# Altium project PCB_Project2.PrjPCB
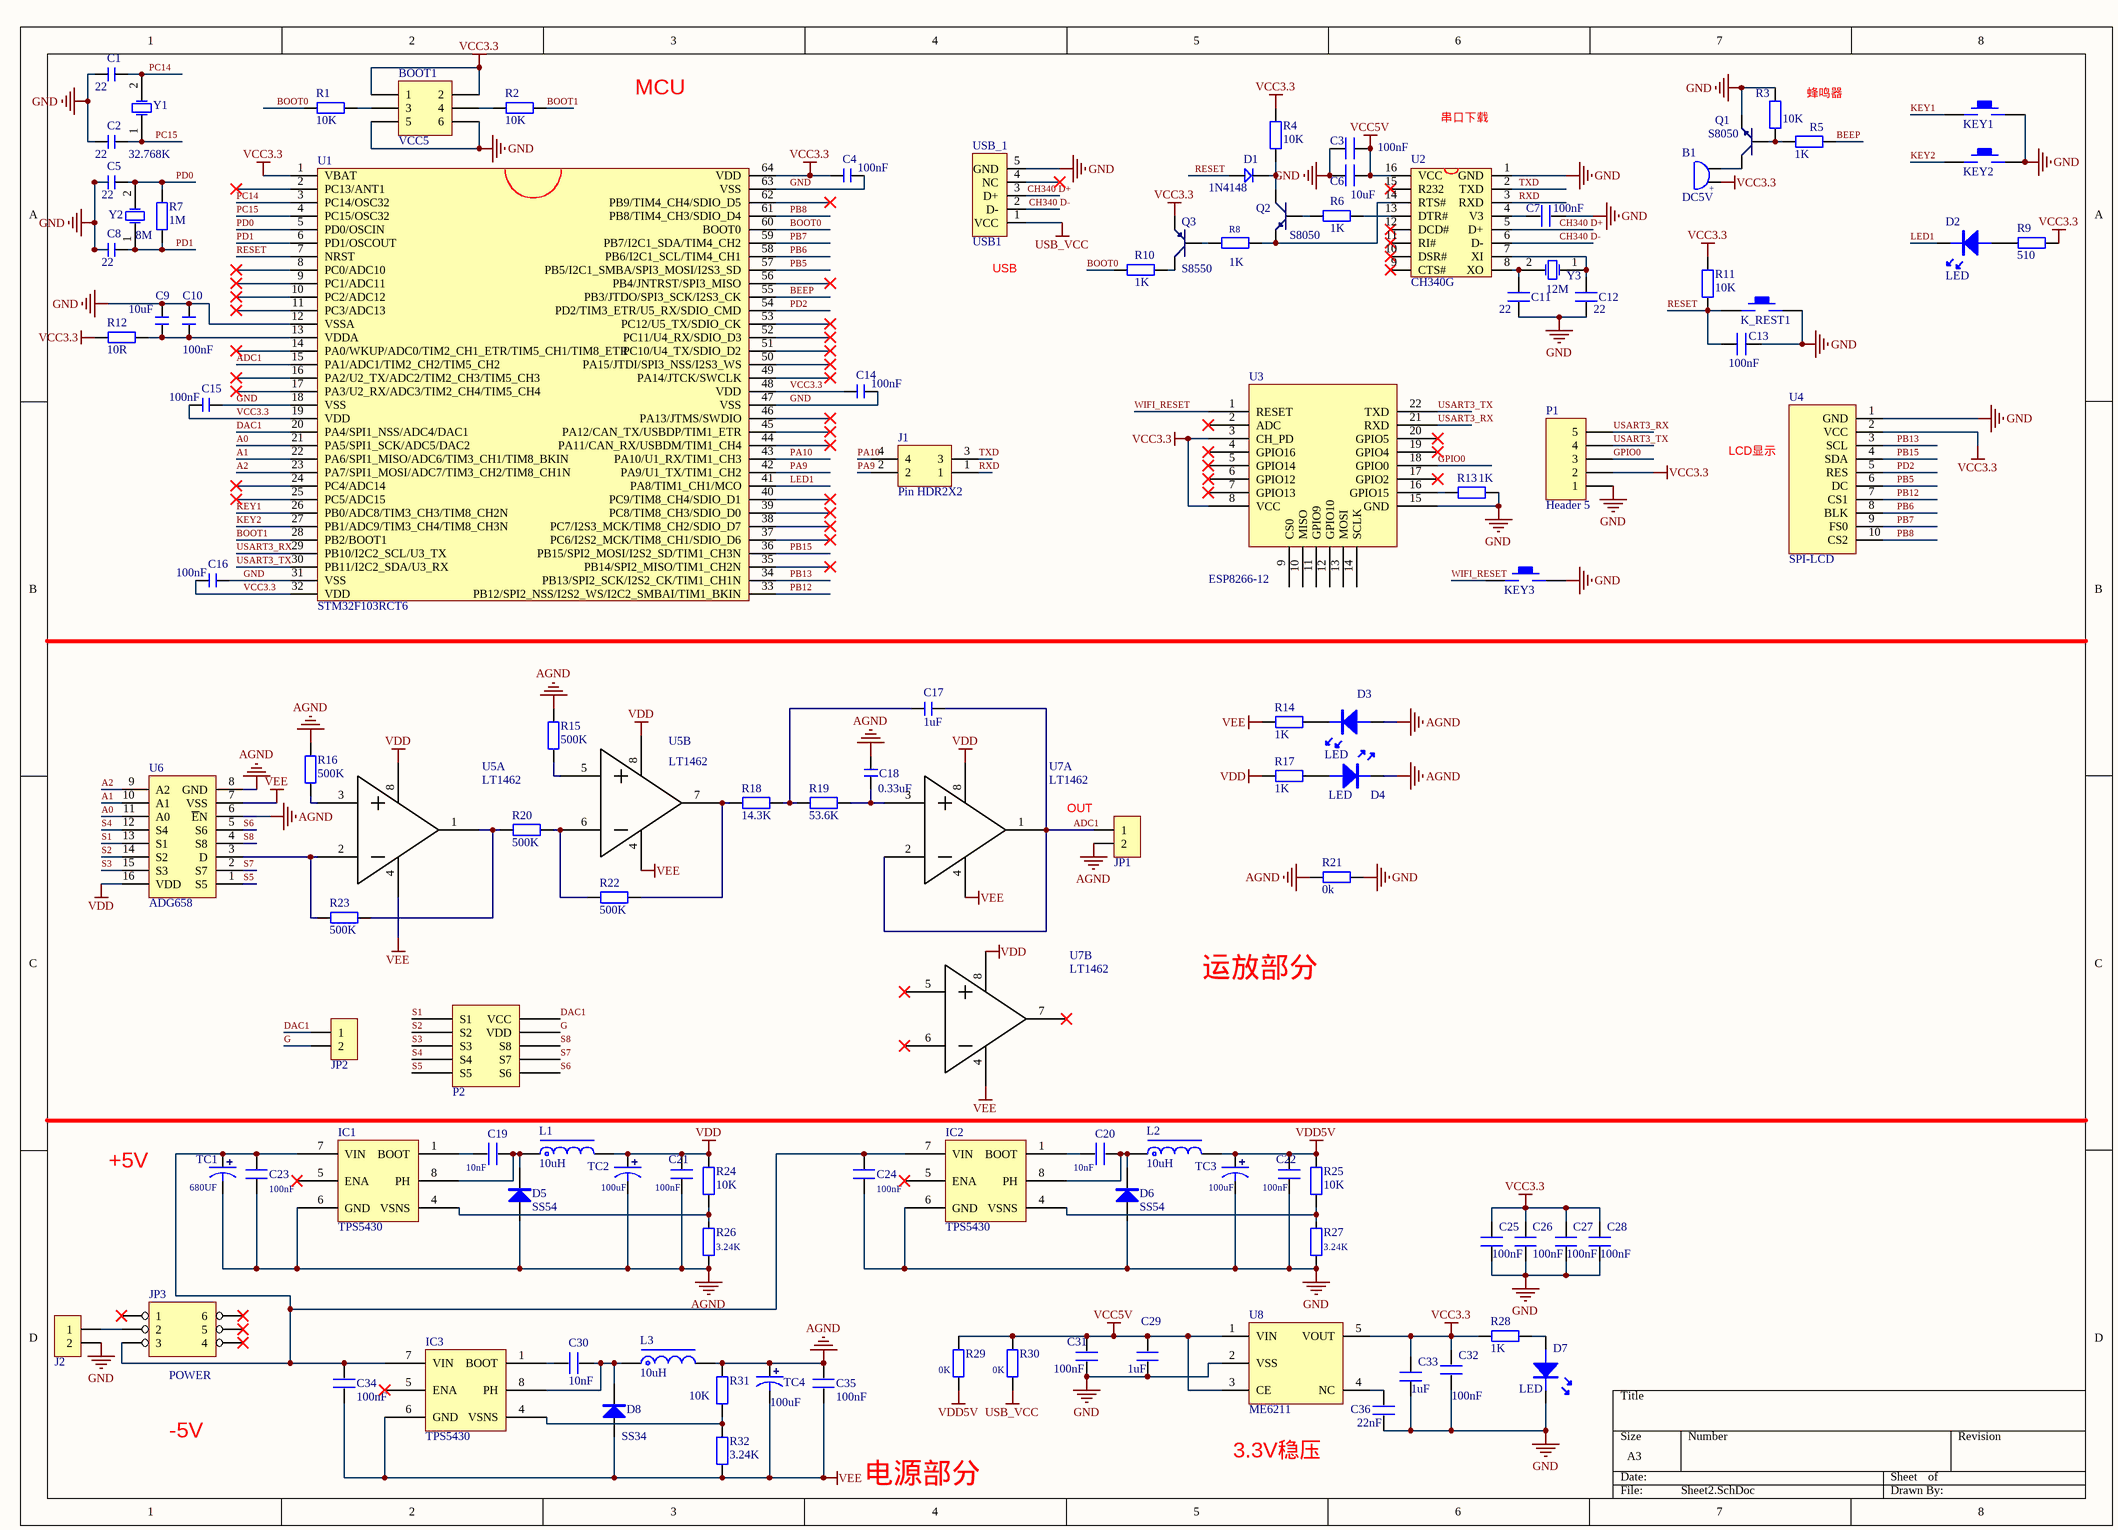
[diagram p0: Sheet2.SchDoc]
1 sheet, 114 parts. Net scope: global (net labels, ports and power ports of the same name join across sheets).
Board file: PCB1.PcbDoc

## Sheet Sheet2.SchDoc
size A3

### Parts
B1  DC5V  [BEEP 7.6x12x7.5]
BOOT1  VCC5  [HDR2X3]
C1  22  [LC-0603_C]
C2  22  [LC-0603_C]
C3  100nF  [LC-0603_C]
C4  100nF  [LC-0603_C]
C5  22  [LC-0603_C]
C6  10uF  [LC-0603_C]
C7  100nF  [LC-0603_C]
C8  22  [LC-0603_C]
C9  10uF  [LC-0603_C]
C10  100nF  [LC-0603_C]
C11  22  [LC-0603_C]
C12  22  [LC-0603_C]
C13  100nF  [LC-0603_C]
C14  100nF  [LC-0603_C]
C15  100nF  [LC-0603_C]
C16  100nF  [LC-0603_C]
C17  1uF  [LC-0603_C]
C18  0.33uF  [LC-0603_C]
C19  10nF  [LC-0603_C]
C20  10nF  [LC-0603_C]
C21  100nF  [LC-0603_C]
C22  100nF  [LC-0603_C]
C23  100nF  [LC-0603_C]
C24  100nF  [LC-0603_C]
C25  100nF  [LC-0603_C]
C26  100nF  [LC-0603_C]
C27  100nF  [LC-0603_C]
C28  100nF  [LC-0603_C]
C29  1uF  [LC-0603_C]
C30  10nF  [LC-0603_C]
C31  100nF  [LC-0603_C]
C32  100nF  [LC-0603_C]
C33  1uF  [LC-0603_C]
C34  100nF  [LC-0603_C]
C35  100nF  [LC-0603_C]
C36  22nF  [LC-0603_C]
D1  1N4148  [DIODE_SOP]
D2  LED  [LED-0805B]
D3  LED  [LED-0805B]
D4  LED  [LED-0805B]
D5  SS54  [LC-SMA(DO-214AC)_S2]
D6  SS54  [LC-SMA(DO-214AC)_S2]
D7  LED  [LED-0805B]
D8  SS34  [LC-SMA(DO-214AC)_S2]
IC1  TPS5430  [SOP8]
IC2  TPS5430  [SOP8]
IC3  TPS5430  [SOP8]
J1  Pin HDR2X2  [Pin HDR2X2/2.54mm-S]
J2  HDR-1X2  [XH2.54-2P]  (value not drawn)
JP1  HDR-1X2  [HDR1X2]  (value not drawn)
JP2  HDR-1X2  [HDR1X2]  (value not drawn)
JP3  POWER  [6脚开关]
K_REST1  KEY_M  [DIP-6X6X5]  (value not drawn)
KEY1  KEY_M  [DIP-6X6X5]  (value not drawn)
KEY2  KEY_M  [DIP-6X6X5]  (value not drawn)
KEY3  KEY_M  [SMD-3X6X2.5]  (value not drawn)
L1  10uH  [L-SMD-0630]
L2  10uH  [L-SMD-0630]
L3  10uH  [L-SMD-0630]
P1  Header 5  [HDR1X5]
P2  senor  [sensor-con pin 10]  (value not drawn)
Q1  S8050  [SOT-23R]
Q2  S8050  [SOT-23R]
Q3  S8550  [SOT-23R]
R1  10K  [R 0603_M]
R2  10K  [R 0603_M]
R3  10K  [R 0603_M]
R4  10K  [R 0603_M]
R5  1K  [R 0603_M]
R6  1K  [R 0603_M]
R7  1M  [R 0603_M]
R8  1K  [R 0603_M]
R9  510  [R 0603_M]
R10  1K  [R 0603_M]
R11  10K  [R 0603_M]
R12  10R  [R 0603_M]
R13  1K  [R 0603_M]
R14  1K  [R 0603_M]
R15  500K  [R 0603_M]
R16  500K  [R 0603_M]
R17  1K  [R 0603_M]
R18  14.3K  [R 0603_M]
R19  53.6K  [R 0603_M]
R20  500K  [R 0603_M]
R21  0k  [R 0603_M]
R22  500K  [R 0603_M]
R23  500K  [R 0603_M]
R24  10K  [R 0603_M]
R25  10K  [R 0603_M]
R26  3.24K  [R 0603_M]
R27  3.24K  [R 0603_M]
R28  1K  [R 0603_M]
R29  0K  [R 0603_M]
R30  0K  [R 0603_M]
R31  10K  [R 0603_M]
R32  3.24K  [R 0603_M]
TC1  680UF  [SMD-EC6.3X6.3X10]
TC2  100uF  [TAJ-A/3216]
TC3  100uF  [TAJ-A/3216]
TC4  100uF  [TAJ-A/3216]
U1  STM32F103RCT6  [LQFP64]
U2  CH340G  [SOP16M]
U3  ESP8266-12  [ESP8266-12]
U4  SPI-LCD  [Fe-HDR1X10/2.54-S]
U5  LT1462  [SOP8]  (parts A,B of 2)
U6  ADG658  [ADG658-SOP-16]
U7  LT1462  [SOP8]  (parts A,B of 2)
U8  ME6211  [SOT23-5]
USB_1  USB1  [USB-micro_B]
Y1  32.768K  [OSC 3215-2P]
Y2  8M  [OSC 5032-2P]
Y3  12M  [OSC 5032-2P]

### Nets
AGND: C18.1 C21.2 C23.1 C35.1 D3.A D4.K D5.1(A) IC1.6(GND) JP1.2 L3.2 R15.1 R16.1 R21.2 R26.1 R31.2 TC1.2 TC2.2 TC4.1 U6.6(~{E}N) U6.8(GND)
GND: BOOT1.5 BOOT1.6 C1.1 C2.1 C3.1 C4.1 C5.1 C6.1 C7.2 C8.1 C9.2 C10.2 C11.1 C12.1 C13.1 C14.1 C15.1 C16.1 C22.2 C24.1 C25.2 C26.2 C27.2 C28.2 C29.2 C31.2 C32.2 C33.2 C36.2 D6.1(A) D7.K IC2.6(GND) J2.2 K_REST1.2 KEY1.2 KEY2.2 KEY3.2 P1.1 Q1.1(E) R3.1 R13.1 R21.1 R27.1 TC3.2 U1.12(VSSA) U1.18(VSS) U1.31(VSS) U1.47(VSS) U1.63(VSS) U2.1(GND) U3.15(GND) U4.1(GND) U8.2(VSS) USB_1.5(GND)
USB_VCC: R30.1 USB_1.1(VCC)
VCC3.3: B1.1 BOOT1.1 BOOT1.2 C4.2 C14.2 C15.2 C16.2 C25.1 C26.1 C27.1 C28.1 C32.1 C33.1 P1.2 Q3.1(E) R4.1 R9.1 R11.2 R12.2 R28.2 U1.1(VBAT) U1.19(VDD) U1.32(VDD) U1.48(VDD) U1.64(VDD) U3.3(CH_PD) U3.8(VCC) U4.2(VCC) U8.5(VOUT)
VCC5V: C3.2 C6.2 C29.1 C31.1 R29.2 R30.2 U2.16(VCC) U8.1(VIN) U8.3(CE)
VDD: C21.1 L1.2 R17.2 R24.2 TC2.1 U5.8(v+) U6.16(VDD) U7.8(v+)
VDD5V: C22.1 L2.2 R25.2 R29.1 TC3.1
VEE: C34.1 C35.2 D8.1(A) IC3.6(GND) R14.2 R32.1 TC4.2 U5.4(v-) U6.7(VSS) U7.4(v-)
A0: U1.21(PA5/SPI1_SCK/ADC5/DAC2) U6.11(A0)
A1: U1.22(PA6/SPI1_MISO/ADC6/TIM3_CH1/TIM8_BKIN) U6.10(A1)
A2: U1.23(PA7/SPI1_MOSI/ADC7/TIM3_CH2/TIM8_CH1N) U6.9(A2)
ADC1: C17.2 JP1.1 U1.15(PA1/ADC1/TIM2_CH2/TIM5_CH2) U7.1(out) U7.2(-)
BEEP: R5.2 U1.55(PB3/JTDO/SPI3_SCK/I2S3_CK)
BOOT0: R1.1 R10.2 U1.60(BOOT0)
BOOT1: R2.2 U1.28(PB2/BOOT1)
CH340 D+: U2.5(D+) USB_1.3(D+)
CH340 D-: U2.6(D-) USB_1.2(D-)
DAC1: JP2.1 P2.10(VCC) U1.20(PA4/SPI1_NSS/ADC4/DAC1)
G: JP2.2 P2.9(VDD)
GPIO0: P1.3 U3.18(GPIO0)
KEY1: KEY1.1 U1.26(PB0/ADC8/TIM3_CH3/TIM8_CH2N)
KEY2: KEY2.1 U1.27(PB1/ADC9/TIM3_CH4/TIM8_CH3N)
LED1: D2.K U1.41(PA8/TIM1_CH1/MCO)
PA9: J1.2 U1.42(PA9/U1_TX/TIM1_CH2)
PA10: J1.4 U1.43(PA10/U1_RX/TIM1_CH3)
PB5: U1.57(PB5/I2C1_SMBA/SPI3_MOSI/I2S3_SD) U4.6(DC)
PB6: U1.58(PB6/I2C1_SCL/TIM4_CH1) U4.8(BLK)
PB7: U1.59(PB7/I2C1_SDA/TIM4_CH2) U4.9(FS0)
PB8: U1.61(PB8/TIM4_CH3/SDIO_D4) U4.10(CS2)
PB12: U1.33(PB12/SPI2_NSS/I2S2_WS/I2C2_SMBAI/TIM1_BKIN) U4.7(CS1)
PB13: U1.34(PB13/SPI2_SCK/I2S2_CK/TIM1_CH1N) U4.3(SCL)
PB15: U1.36(PB15/SPI2_MOSI/I2S2_SD/TIM1_CH3N) U4.4(SDA)
PC14: C1.2 U1.3(PC14/OSC32) Y1.2(OSC2)
PC15: C2.2 U1.4(PC15/OSC32) Y1.1(OSC1)
PD0: C5.2 R7.2 U1.5(PD0/OSCIN) Y2.2(OSC2)
PD1: C8.2 R7.1 U1.6(PD1/OSCOUT) Y2.1(OSC1)
PD2: U1.54(PD2/TIM3_ETR/U5_RX/SDIO_CMD) U4.5(RES)
RESET: C13.2 D1.1 K_REST1.1 R11.1 U1.7(NRST)
RXD: J1.1 U2.3(RXD)
S1: P2.1(S1) U6.13(S1)
S2: P2.2(S2) U6.14(S2)
S3: P2.3(S3) U6.15(S3)
S4: P2.4(S4) U6.12(S4)
S5: P2.5(S5) U6.1(S5)
S6: P2.6(S6) U6.5(S6)
S7: P2.7(S7) U6.2(S7)
S8: P2.8(S8) U6.4(S8)
TXD: J1.3 U2.2(TXD)
USART3_RX: P1.5 U1.29(PB10/I2C2_SCL/U3_TX) U3.21(RXD)
USART3_TX: P1.4 U1.30(PB11/I2C2_SDA/U3_RX) U3.22(TXD)
WIFI_RESET: KEY3.1 U3.1(RESET)
NetB1_2: B1.2 Q1.3(C)
NetBOOT1_3: BOOT1.3 R1.2
NetBOOT1_4: BOOT1.4 R2.1
NetC7_1: C7.1 U2.4(V3)
NetC9_1: C9.1 C10.1 R12.1 U1.13(VDDA)
NetC11_2: C11.2 U2.8(XO) Y3.2(OSC2)
NetC12_2: C12.2 U2.7(XI) Y3.1(OSC1)
NetC17_1: C17.1 R18.2 R19.1
NetC18_2: C18.2 R19.2 U7.3(+)
NetC19_1: C19.1 D5.2(K) IC1.8(PH) L1.1
NetC19_2: C19.2 IC1.1(BOOT)
NetC20_1: C20.1 D6.2(K) IC2.8(PH) L2.1
NetC20_2: C20.2 IC2.1(BOOT)
NetC23_2: C23.2 C24.2 C34.2 IC1.7(VIN) IC2.7(VIN) IC3.7(VIN) JP3.3 TC1.1
NetC30_1: C30.1 D8.2(K) IC3.8(PH) L3.1
NetC30_2: C30.2 IC3.1(BOOT)
NetC36_1: C36.1 U8.4(NC)
NetD1_2: D1.2 Q2.3(C) R4.2
NetD2_A: D2.A R9.2
NetD3_K: D3.K R14.1
NetD4_A: D4.A R17.1
NetD7_A: D7.A R28.1
NetIC1_4: IC1.4(VSNS) R24.1 R26.2
NetIC2_4: IC2.4(VSNS) R25.1 R27.2
NetIC3_4: IC3.4(VSNS) R31.1 R32.2
NetJ2_1: J2.1 JP3.2
NetQ1_2: Q1.2(B) R3.2 R5.1
NetQ2_1: Q2.1(E) R8.1 U2.14(RTS#)
NetQ2_2: Q2.2(B) R6.2
NetQ3_2: Q3.2(B) R8.2
NetQ3_3: Q3.3(C) R10.1
NetR6_1: R6.1 U2.13(DTR#)
NetR13_2: R13.2 U3.16(GPIO15)
NetR15_2: R15.2 U5.5(+)
NetR16_2: R16.2 U5.3(+)
NetR18_1: R18.1 R22.2 U5.7(out)
NetR20_1: R20.1 R23.2 U5.1(out)
NetR20_2: R20.2 R22.1 U5.6(-)
NetR23_1: R23.1 U5.2(-) U6.3(D)

Not connected (* = marked no-connect by the designer): IC1 5(ENA)*; IC2 5(ENA)*; IC3 5(ENA)*; JP3 1* 4* 5* 6*; U1 2(PC13/ANT1)* 8(PC0/ADC10)* 9(PC1/ADC11)* 10(PC2/ADC12)* 11(PC3/ADC13)* 14(PA0/WKUP/ADC0/TIM2_CH1_ETR/TIM5_CH1/TIM8_ETR)* 16(PA2/U2_TX/ADC2/TIM2_CH3/TIM5_CH3)* 17(PA3/U2_RX/ADC3/TIM2_CH4/TIM5_CH4)* 24(PC4/ADC14)* 25(PC5/ADC15)* 35(PB14/SPI2_MISO/TIM1_CH2N)* 37(PC6/I2S2_MCK/TIM8_CH1/SDIO_D6)* 38(PC7/I2S3_MCK/TIM8_CH2/SDIO_D7)* 39(PC8/TIM8_CH3/SDIO_D0)* 40(PC9/TIM8_CH4/SDIO_D1)* 44(PA11/CAN_RX/USBDM/TIM1_CH4)* 45(PA12/CAN_TX/USBDP/TIM1_ETR)* 46(PA13/JTMS/SWDIO)* 49(PA14/JTCK/SWCLK)* 50(PA15/JTDI/SPI3_NSS/I2S3_WS)* 51(PC10/U4_TX/SDIO_D2)* 52(PC11/U4_RX/SDIO_D3)* 53(PC12/U5_TX/SDIO_CK)* 56(PB4/JNTRST/SPI3_MISO)* 62(PB9/TIM4_CH4/SDIO_D5)*; U2 9(CTS#)* 10(DSR#)* 11(RI#)* 12(DCD#)* 15(R232)*; U3 2(ADC)* 4(GPIO16)* 5(GPIO14)* 6(GPIO12)* 7(GPIO13)* 9(CS0) 10(MISO) 11(GPIO9) 12(GPIO10) 13(MOSI) 14(SCLK) 17(GPIO2)* 19(GPIO4)* 20(GPIO5)*; U7 5(+)* 6(-)* 7(out)*; USB_1 4(NC)*

### Notes on the sheet
- MCU
- (near U2) 串口下载
- 蜂鸣器
- (near USB_1) USB
- LCD显示
- (near JP1) OUT
- 运放部分
- +5V
- -5V
- (near U8) 3.3V稳压
- 电源部分
- (in symbol BEEP) +

### Library data of the parts
B1 = BEEP: 蜂鸣器; 版权归属: 源创客; BOM名称: 蜂鸣器; 学习资源: www.ooocke.com
BOOT1 = Header 3X2: Header, 3-Pin, Dual row; LatestRevisionDate: 17-Jul-2002; LatestRevisionNote: Re-released for DXP Platform.; Publisher: Altium Limited
C1 C2 C4 C5 C8-C10 C14-C16 = C_1: 无极性贴片电容; 版权归属: 源创客; BOM名称: 无极性贴片电容; 学习资源: www.ooocke.com
C3 C6 C7 C11-C13 C19-C36 = C
C17 C18 = C: 无极性贴片电容; 版权归属: 源创客; BOM名称: 无极性贴片电容; 学习资源: www.ooocke.com
D1 = D
D5 D6 D8 = SS54: 肖特基二极管; 版权归属: 源创客; 属性: 40V/2A; BOM名称: 肖特基二极管; 学习资源: www.ooocke.com
J2 = Header 2_1: 2P接插件; 版权归属: 源创客; BOM名称: 2P接插件; 学习资源: www.ooocke.com
JP1 JP2 = Header 2: 2P接插件; 版权归属: 源创客; BOM名称: 2P接插件; 学习资源: www.ooocke.com
JP3 = 6角开关
L1-L3 = L-CDRH: 功率屏蔽电感; 版权归属: 源创客; BOM名称: 功率屏蔽电感; 学习资源: www.ooocke.com
P1 = Header 5: Header, 5-Pin; LatestRevisionDate: 17-Jul-2002; LatestRevisionNote: Re-released for DXP Platform.; Publisher: Altium Limited
Q1 Q2 = NPN: 8050/BCW846/BCW847
Q3 = PNP: 8550/BCW68
R1-R32 = R: 贴片电阻; 版权归属: 源创客; BOM名称: 贴片电阻; 学习资源: www.ooocke.com
TC1-TC4 = TCAP_1: 钽电容
U1 = STM32F103RDT6
U2 = CH340G: USB2UART
U5 U7 = LT1462_1
USB_1 = USB5
Y1-Y3 = XTAL_2: Crystal Oscillator; Published: 8-Jun-2000; LatestRevisionDate: 17-Jul-2002; LatestRevisionNote: Re-released for DXP Platform.; Publisher: Altium Limited